# EasyEDA schematic Caravel_Daughter_Board_2021-09-10.json
TITLE: Caravel Daughter Board; REV: 1.0; Date: 2021-05-19; Sheet: 1/1; Drawn By: mshalan; Company: Efabless Corp
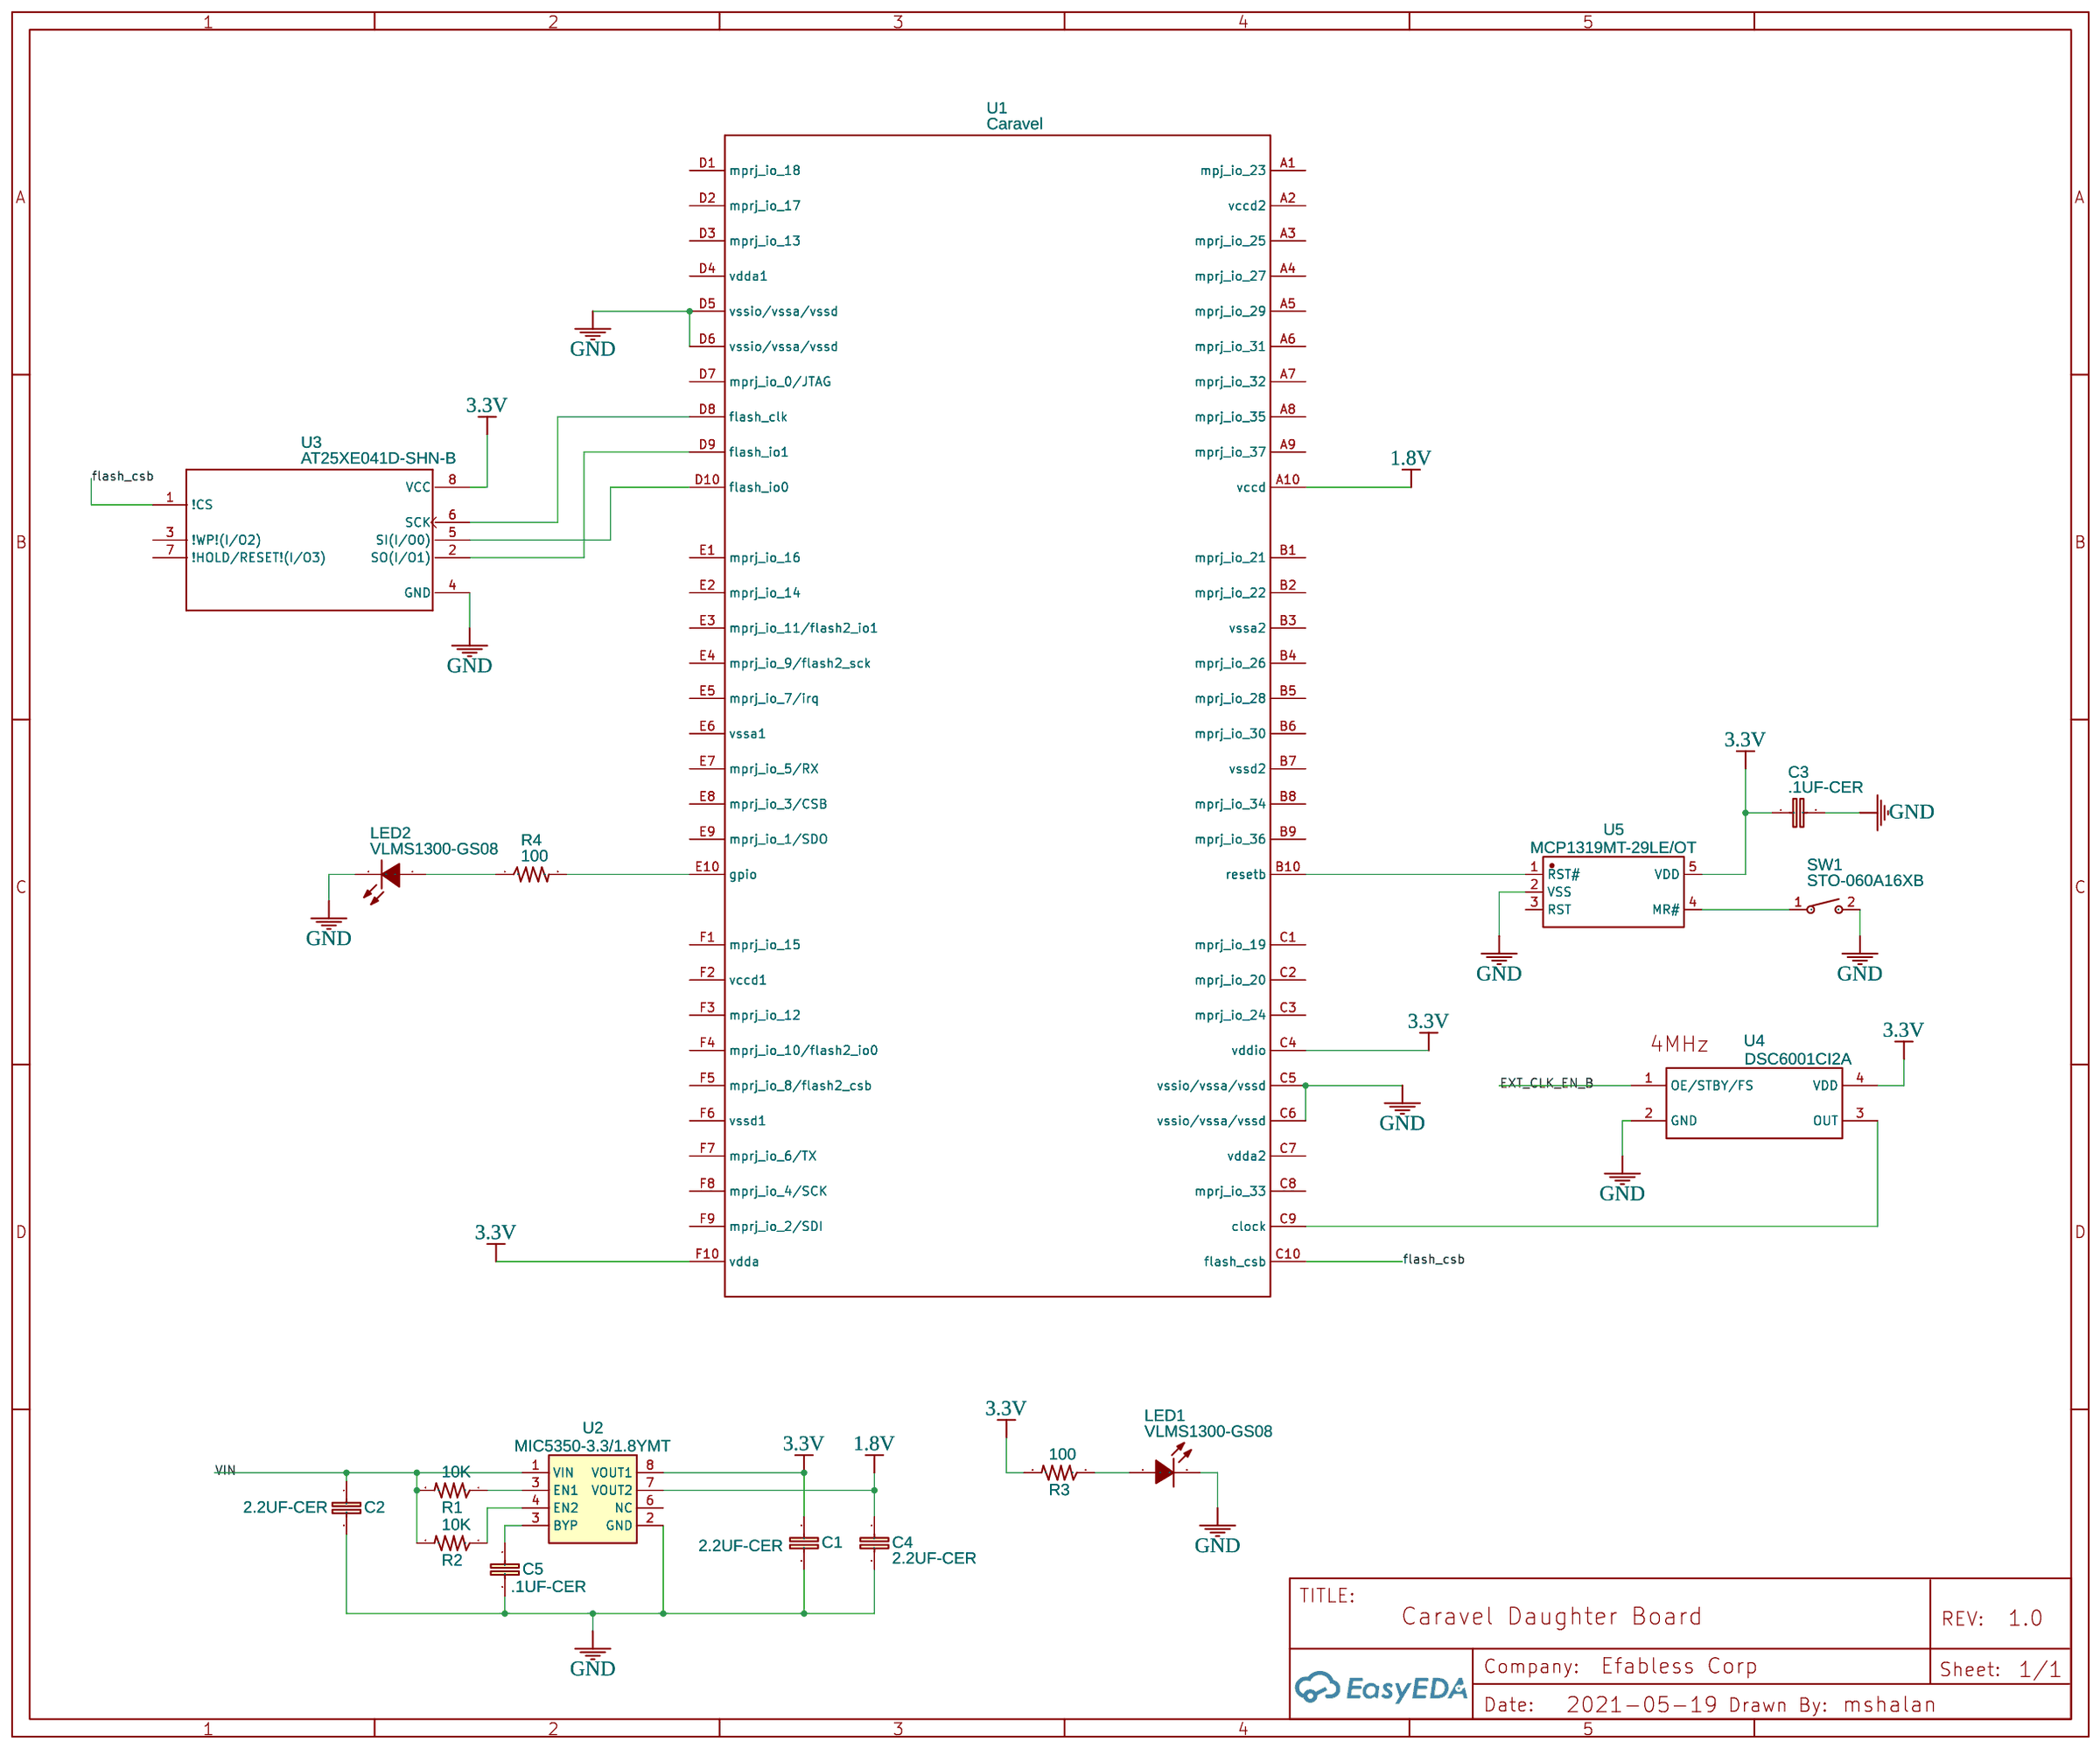
[diagram p0: schematic sheet]

## Parts
C1  2.2UF-CER  [0402-CAP]
C2  2.2UF-CER  [0402-CAP]
C3  .1UF-CER  [0402-CAP]
C4  2.2UF-CER  [0402-CAP]
C5  .1UF-CER  [0402-CAP]
LED1  VLMS1300-GS08  [LED0603-R-RD]
LED2  VLMS1300-GS08  [LED0603-R-RD]
R1  10K  [0402-RES]
R2  10K  [0402-RES]
R3  100  [0402-RES]
R4  100  [0402-RES]
SW1  STO-060A16XB  [KEY-SMD_L3.0-W2.0-LS3.5]
U1  Caravel
U2  MIC5350-3.3/1.8YMT  [TMLF-8]
U3  AT25XE041D-SHN-B  [SOIC127P790X216-8N]
U4  DSC6001CI2A  [3.2MM_X_2.5MM_4PIN_SMD]
U5  MCP1319MT-29LE/OT  [SOT-23-5_L3.0-W1.7-P0.95-LS2.8-BR]

## Library data of the parts
C1 C2 C4 = 2.2UF-CERCAP-07888: 2.2uF Ceramic SMT; Contributor: SparkFun
C3 C5 = .1UF-CERCAP-08604: .1uF ceramic SMT; Contributor: SparkFun
LED1 LED2 = VLMS1300-GS08: Supplier: LCSC; Supplier Part: C83242; Manufacturer: Vishay Intertech; Contributor: LCSC
R1-R4 = RESISTOR0402: Resistor; Contributor: SparkFun
SW1 = STO-060A16XB: Supplier: LCSC; Supplier Part: C515305; Manufacturer: Mitsumi Electric; Contributor: LCSC
U1 = Caravel: Manufacturer: Efabless; Supplier: Efabless; Contributor: mshalan
U2 = MIC5350-3.3/1.8YMT: Contributor: jtigchelaar
U3 = AT25XE041D-SHN-B: Contributor: 45crobotics
U4 = DSC6001CI2A-016.0000T: Contributor: HenryTR
U5 = MCP1319MT-29LE/OT: Supplier: LCSC; Supplier Part: C174373; Manufacturer: Microchip Tech; Contributor: LCSC; JLCPCB Part Class: Extended Part

## Nets
1.8V: C4.1 U1.A10(vccd) U2.7(VOUT2)
3.3V: C1.1 C3.1 R3.2 U1.C4(vddio) U1.F10(vdda) U2.8(VOUT1) U3.8(VCC) U4.4(VDD) U5.5(VDD)
GND: C1.2 C2.2 C3.2 C4.2 C5.2 LED1.2(C) LED2.2(C) SW1.2 U1.C5(vssio/vssa/vssd) U1.C6(vssio/vssa/vssd) U1.D5(vssio/vssa/vssd) U1.D6(vssio/vssa/vssd) U2.2(GND) U3.4(GND) U4.2(GND) U5.2(VSS)
VIN: C2.1 R1.2 R2.2 U2.1(VIN)
EXT_CLK_EN_B: U4.1(OE/STBY/FS)
flash_csb: U1.C10(flash_csb) U3.1(!CS)
Net-(C5-1): C5.1 R1.1 U2.3(EN1)
Net-(LED1-1): LED1.1(A) R3.1
Net-(LED2-1): LED2.1(A) R4.1
Net-(R2-1): R2.1 U2.4(EN2)
Net-(R4-2): R4.2 U1.E10(gpio)
Net-(SW1-1): SW1.1 U5.4(MR#)
Net-(U1-B10): U1.B10(resetb) U5.1(RST#)
Net-(U1-C9): U1.C9(clock) U4.3(OUT)
Net-(U1-D8): U1.D8(flash_clk) U3.6(SCK)
Net-(U1-D9): U1.D9(flash_io1) U3.2(SO(I/O1))
Net-(U1-D10): U1.D10(flash_io0) U3.5(SI(I/O0))

Not connected (* = marked no-connect by the designer): U1 A1(mpj_io_23) A2(vccd2) A3(mprj_io_25) A4(mprj_io_27) A5(mprj_io_29) A6(mprj_io_31) A7(mprj_io_32) A8(mprj_io_35) A9(mprj_io_37) B1(mprj_io_21) B2(mprj_io_22) B3(vssa2) B4(mprj_io_26) B5(mprj_io_28) B6(mprj_io_30) B7(vssd2) B8(mprj_io_34) B9(mprj_io_36) C1(mprj_io_19) C2(mprj_io_20) C3(mprj_io_24) C7(vdda2) C8(mprj_io_33) D1(mprj_io_18) D2(mprj_io_17) D3(mprj_io_13) D4(vdda1) D7(mprj_io_0/JTAG) E1(mprj_io_16) E2(mprj_io_14) E3(mprj_io_11/flash2_io1) E4(mprj_io_9/flash2_sck) E5(mprj_io_7/irq) E6(vssa1) E7(mprj_io_5/RX) E8(mprj_io_3/CSB) E9(mprj_io_1/SDO) F1(mprj_io_15) F2(vccd1) F3(mprj_io_12) F4(mprj_io_10/flash2_io0) F5(mprj_io_8/flash2_csb) F6(vssd1) F7(mprj_io_6/TX) F8(mprj_io_4/SCK) F9(mprj_io_2/SDI); U2 6(NC); U3 3(!WP!(I/O2)) 7(!HOLD/RESET!(I/O3)); U5 3(RST)
